# Altium schematic sheet S04.SchDoc: IEEE-1394/Ethernet FPGA Controller
size 381 x 254 mm; Revision: 2.1; SheetNumber: 4; SheetTotal: 6
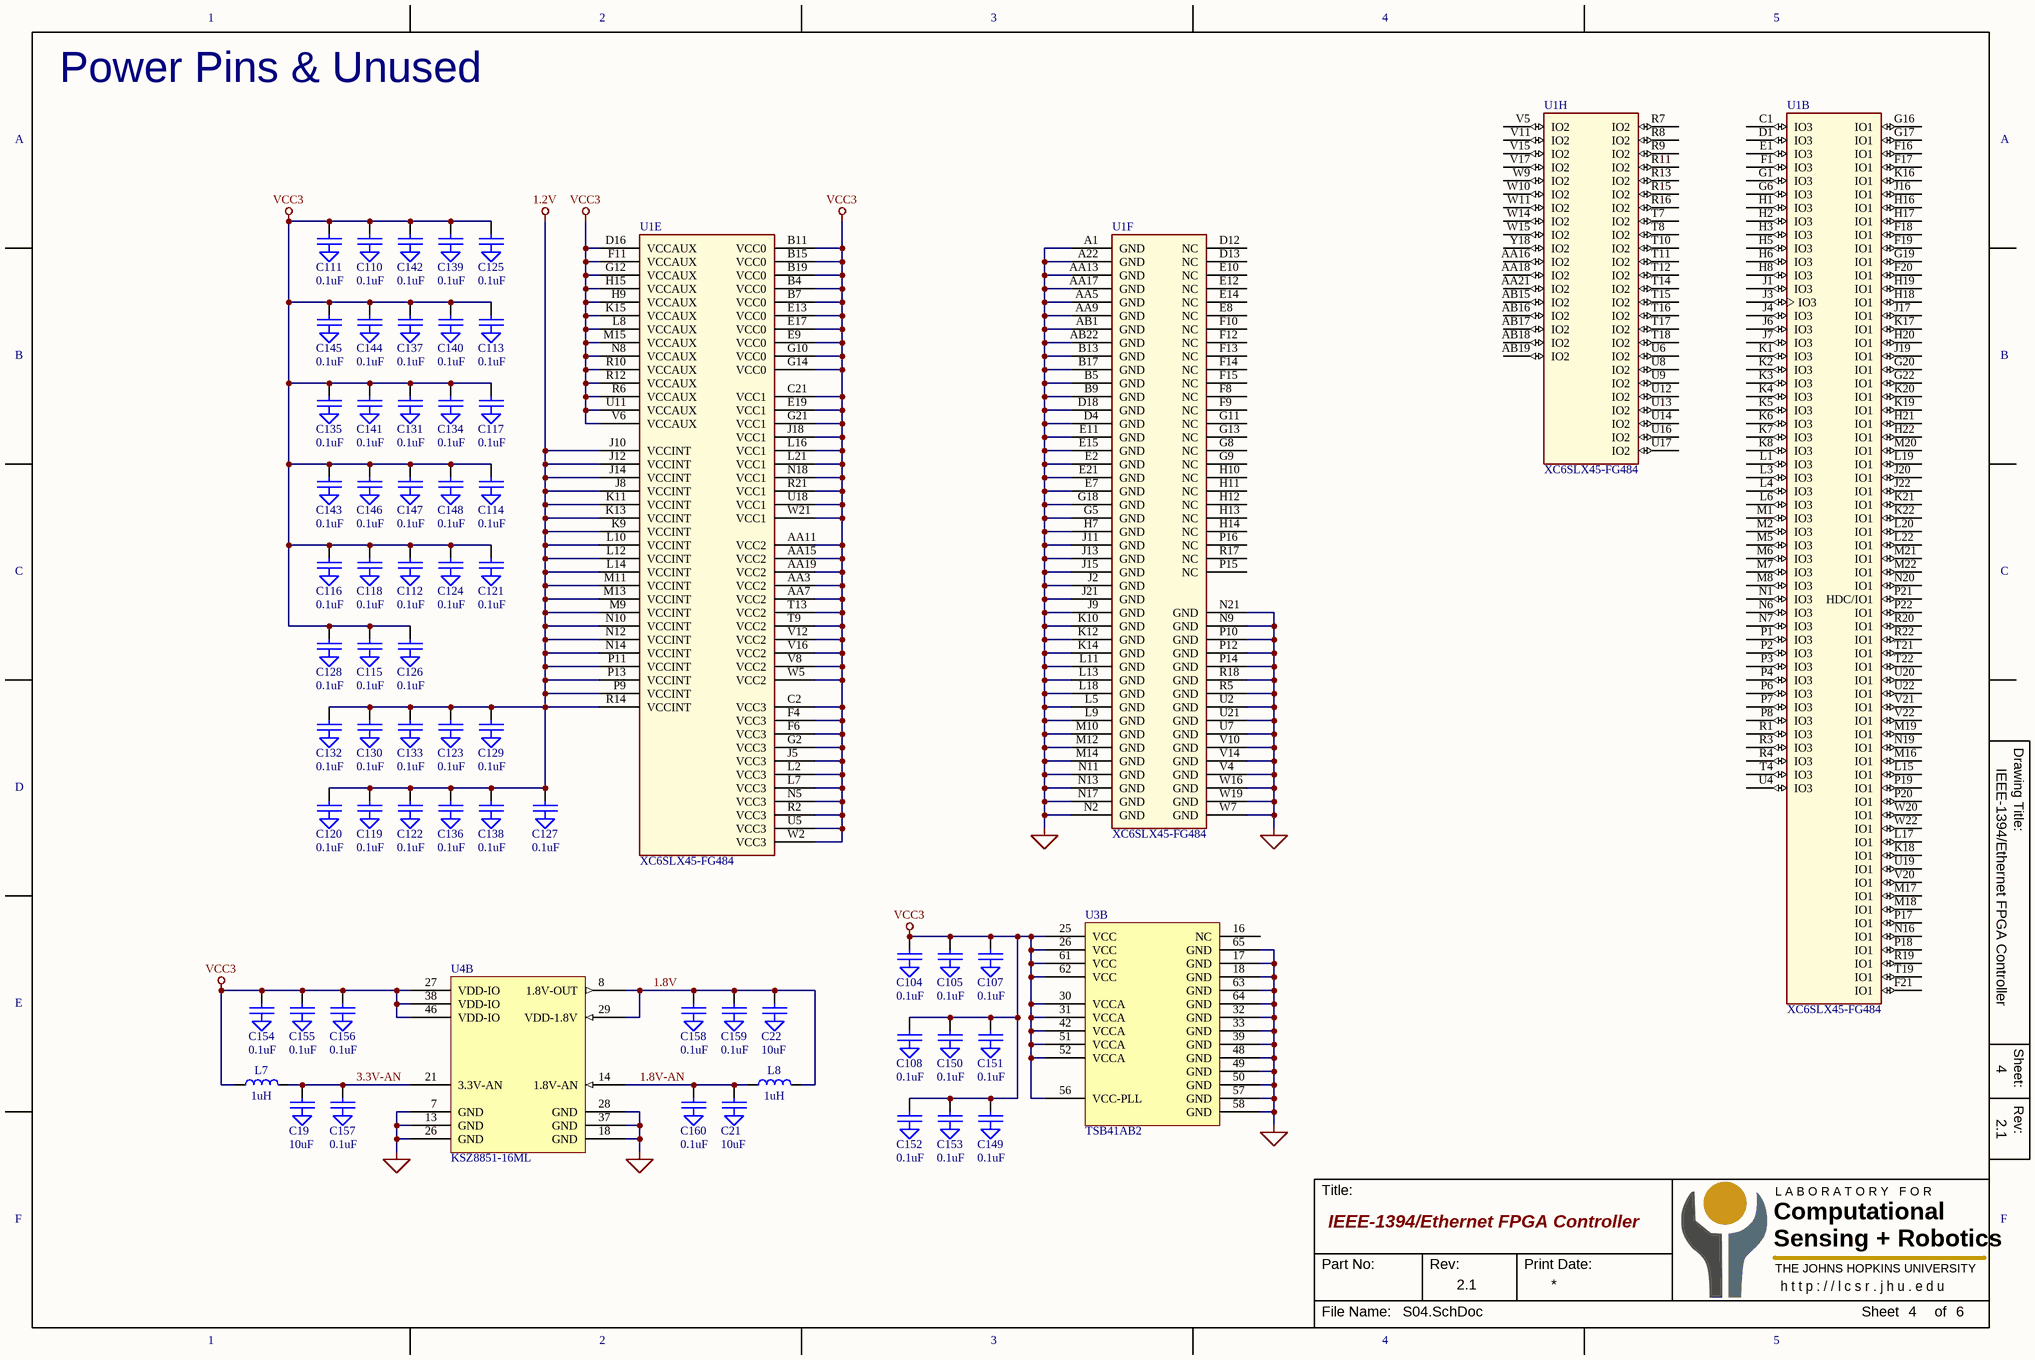
[diagram p0: S04.SchDoc]

## Parts
C19  10uF  [C0603]
C21  10uF  [C0603]
C22  10uF  [C0603]
C104  0.1uF  [C0402]
C105  0.1uF  [C0402]
C107  0.1uF  [C0402]
C108  0.1uF  [C0402]
C110  0.1uF  [C0402]
C111  0.1uF  [C0402]
C112  0.1uF  [C0402]
C113  0.1uF  [C0402]
C114  0.1uF  [C0402]
C115  0.1uF  [C0402]
C116  0.1uF  [C0402]
C117  0.1uF  [C0402]
C118  0.1uF  [C0402]
C119  0.1uF  [C0402]
C120  0.1uF  [C0402]
C121  0.1uF  [C0402]
C122  0.1uF  [C0402]
C123  0.1uF  [C0402]
C124  0.1uF  [C0402]
C125  0.1uF  [C0402]
C126  0.1uF  [C0402]
C127  0.1uF  [C0402]
C128  0.1uF  [C0402]
C129  0.1uF  [C0402]
C130  0.1uF  [C0402]
C131  0.1uF  [C0402]
C132  0.1uF  [C0402]
C133  0.1uF  [C0402]
C134  0.1uF  [C0402]
C135  0.1uF  [C0402]
C136  0.1uF  [C0402]
C137  0.1uF  [C0402]
C138  0.1uF  [C0402]
C139  0.1uF  [C0402]
C140  0.1uF  [C0402]
C141  0.1uF  [C0402]
C142  0.1uF  [C0402]
C143  0.1uF  [C0402]
C144  0.1uF  [C0402]
C145  0.1uF  [C0402]
C146  0.1uF  [C0402]
C147  0.1uF  [C0402]
C148  0.1uF  [C0402]
C149  0.1uF  [C0402]
C150  0.1uF  [C0402]
C151  0.1uF  [C0402]
C152  0.1uF  [C0402]
C153  0.1uF  [C0402]
C154  0.1uF  [C0402]
C155  0.1uF  [C0402]
C156  0.1uF  [C0402]
C157  0.1uF  [C0402]
C158  0.1uF  [C0402]
C159  0.1uF  [C0402]
C160  0.1uF  [C0402]
L7  1uH  [L0603]
L8  1uH  [L0603]
U1  XC6SLX45-FG484  [FG-484]  (parts B,E,F,H of 8)
U3  TSB41AB2  [PQFP-65]  (part B of 2)
U4  KSZ8851-16ML  [QFP-48-7MM]  (part B of 2)

## Nets
1.2V: C119.1 C120.1 C122.1 C123.1 C127.1 C129.1 C130.1 C132.1 C133.1 C136.1 C138.1 U1.J8(VCCINT) U1.J10(VCCINT) U1.J12(VCCINT) U1.J14(VCCINT) U1.K9(VCCINT) U1.K11(VCCINT) U1.K13(VCCINT) U1.L10(VCCINT) U1.L12(VCCINT) U1.L14(VCCINT) U1.M9(VCCINT) U1.M11(VCCINT) U1.M13(VCCINT) U1.N10(VCCINT) U1.N12(VCCINT) U1.N14(VCCINT) U1.P9(VCCINT) U1.P11(VCCINT) U1.P13(VCCINT) U1.R14(VCCINT)
GND: C19.2(GND) C21.2(GND) C22.2(GND) C104.2(GND) C105.2(GND) C107.2(GND) C108.2(GND) C110.2(GND) C111.2(GND) C112.2(GND) C113.2(GND) C114.2(GND) C115.2(GND) C116.2(GND) C117.2(GND) C118.2(GND) C119.2(GND) C120.2(GND) C121.2(GND) C122.2(GND) C123.2(GND) C124.2(GND) C125.2(GND) C126.2(GND) C127.2(GND) C128.2(GND) C129.2(GND) C130.2(GND) C131.2(GND) C132.2(GND) C133.2(GND) C134.2(GND) C135.2(GND) C136.2(GND) C137.2(GND) C138.2(GND) C139.2(GND) C140.2(GND) C141.2(GND) C142.2(GND) C143.2(GND) C144.2(GND) C145.2(GND) C146.2(GND) C147.2(GND) C148.2(GND) C149.2(GND) C150.2(GND) C151.2(GND) C152.2(GND) C153.2(GND) C154.2(GND) C155.2(GND) C156.2(GND) C157.2(GND) C158.2(GND) C159.2(GND) C160.2(GND) U1.A1(GND) U1.A22(GND) U1.AA5(GND) U1.AA9(GND) U1.AA13(GND) U1.AA17(GND) U1.AB1(GND) U1.AB22(GND) U1.B5(GND) U1.B9(GND) U1.B13(GND) U1.B17(GND) U1.D4(GND) U1.D18(GND) U1.E2(GND) U1.E7(GND) U1.E11(GND) U1.E15(GND) U1.E21(GND) U1.G5(GND) U1.G18(GND) U1.H7(GND) U1.J2(GND) U1.J9(GND) U1.J11(GND) U1.J13(GND) U1.J15(GND) U1.J21(GND) U1.K10(GND) U1.K12(GND) U1.K14(GND) U1.L5(GND) U1.L9(GND) U1.L11(GND) U1.L13(GND) U1.L18(GND) U1.M10(GND) U1.M12(GND) U1.M14(GND) U1.N2(GND) U1.N9(GND) U1.N11(GND) U1.N13(GND) U1.N17(GND) U1.N21(GND) U1.P10(GND) U1.P12(GND) U1.P14(GND) U1.R5(GND) U1.R18(GND) U1.U2(GND) U1.U7(GND) U1.U21(GND) U1.V4(GND) U1.V10(GND) U1.V14(GND) U1.W7(GND) U1.W16(GND) U1.W19(GND) U3.17(GND) U3.18(GND) U3.32(GND) U3.33(GND) U3.39(GND) U3.48(GND) U3.49(GND) U3.50(GND) U3.57(GND) U3.58(GND) U3.63(GND) U3.64(GND) U3.65(GND) U4.7(GND) U4.13(GND) U4.18(GND) U4.26(GND) U4.28(GND) U4.37(GND)
VCC3: C104.1 C105.1 C107.1 C108.1 C110.1 C111.1 C112.1 C113.1 C114.1 C115.1 C116.1 C117.1 C118.1 C121.1 C124.1 C125.1 C126.1 C128.1 C131.1 C134.1 C135.1 C137.1 C139.1 C140.1 C141.1 C142.1 C143.1 C144.1 C145.1 C146.1 C147.1 C148.1 C149.1 C150.1 C151.1 C152.1 C153.1 C154.1 C155.1 C156.1 L7.1 U1.AA3(VCC2) U1.AA7(VCC2) U1.AA11(VCC2) U1.AA15(VCC2) U1.AA19(VCC2) U1.B4(VCC0) U1.B7(VCC0) U1.B11(VCC0) U1.B15(VCC0) U1.B19(VCC0) U1.C2(VCC3) U1.C21(VCC1) U1.D16(VCCAUX) U1.E9(VCC0) U1.E13(VCC0) U1.E17(VCC0) U1.E19(VCC1) U1.F4(VCC3) U1.F6(VCC3) U1.F11(VCCAUX) U1.G2(VCC3) U1.G10(VCC0) U1.G12(VCCAUX) U1.G14(VCC0) U1.G21(VCC1) U1.H9(VCCAUX) U1.H15(VCCAUX) U1.J5(VCC3) U1.J18(VCC1) U1.K15(VCCAUX) U1.L2(VCC3) U1.L7(VCC3) U1.L8(VCCAUX) U1.L16(VCC1) U1.L21(VCC1) U1.M15(VCCAUX) U1.N5(VCC3) U1.N8(VCCAUX) U1.N18(VCC1) U1.R2(VCC3) U1.R6(VCCAUX) U1.R10(VCCAUX) U1.R12(VCCAUX) U1.R21(VCC1) U1.T9(VCC2) U1.T13(VCC2) U1.U5(VCC3) U1.U11(VCCAUX) U1.U18(VCC1) U1.V6(VCCAUX) U1.V8(VCC2) U1.V12(VCC2) U1.V16(VCC2) U1.W2(VCC3) U1.W5(VCC2) U1.W21(VCC1) U3.25(VCC) U3.26(VCC) U3.30(VCCA) U3.31(VCCA) U3.42(VCCA) U3.51(VCCA) U3.52(VCCA) U3.56(VCC-PLL) U3.61(VCC) U3.62(VCC) U4.27(VDD-IO) U4.38(VDD-IO) U4.46(VDD-IO)
1.8V: C22.1 C158.1 C159.1 L8.2 U4.8(1.8V-OUT) U4.29(VDD-1.8V)
1.8V-AN: C21.1 C160.1 L8.1 U4.14(1.8V-AN)
3.3V-AN: C19.1 C157.1 L7.2 U4.21(3.3V-AN)

Not connected (* = marked no-connect by the designer): U1 AA16(IO2) AA18(IO2) AA21(IO2) AB15(IO2) AB16(IO2) AB17(IO2) AB18(IO2) AB19(IO2) C1(IO3) D1(IO3) D12(NC) D13(NC) E1(IO3) E8(NC) E10(NC) E12(NC) E14(NC) F1(IO3) F8(NC) F9(NC) F10(NC) F12(NC) F13(NC) F14(NC) F15(NC) F16(IO1) F17(IO1) F18(IO1) F19(IO1) F20(IO1) F21(IO1) G1(IO3) G6(IO3) G8(NC) G9(NC) G11(NC) G13(NC) G16(IO1) G17(IO1) G19(IO1) G20(IO1) G22(IO1) H1(IO3) H2(IO3) H3(IO3) H5(IO3) H6(IO3) H8(IO3) H10(NC) H11(NC) H12(NC) H13(NC) H14(NC) H16(IO1) H17(IO1) H18(IO1) H19(IO1) H20(IO1) H21(IO1) H22(IO1) J1(IO3) J3(IO3) J4(IO3) J6(IO3) J7(IO3) J16(IO1) J17(IO1) J19(IO1) J20(IO1) J22(IO1) K1(IO3) K2(IO3) K3(IO3) K4(IO3) K5(IO3) K6(IO3) K7(IO3) K8(IO3) K16(IO1) K17(IO1) K18(IO1) K19(IO1) K20(IO1) K21(IO1) K22(IO1) L1(IO3) L3(IO3) L4(IO3) L6(IO3) L15(IO1) L17(IO1) L19(IO1) L20(IO1) L22(IO1) M1(IO3) M2(IO3) M5(IO3) M6(IO3) M7(IO3) M8(IO3) M16(IO1) M17(IO1) M18(IO1) M19(IO1) M20(IO1) M21(IO1) M22(IO1) N1(IO3) N6(IO3) N7(IO3) N16(IO1) N19(IO1) N20(IO1) P1(IO3) P2(IO3) P3(IO3) P4(IO3) P6(IO3) P7(IO3) P8(IO3) P15(NC) P16(NC) P17(IO1) P18(IO1) P19(IO1) P20(IO1) P21(HDC/IO1) P22(IO1) R1(IO3) R3(IO3) R4(IO3) R7(IO2) R8(IO2) R9(IO2) R11(IO2) R13(IO2) R15(IO2) R16(IO2) R17(NC) R19(IO1) R20(IO1) R22(IO1) T4(IO3) T7(IO2) T8(IO2) T10(IO2) T11(IO2) T12(IO2) T14(IO2) T15(IO2) T16(IO2) T17(IO2) T18(IO2) T19(IO1) T21(IO1) T22(IO1) U4(IO3) U6(IO2) U8(IO2) U9(IO2) U12(IO2) U13(IO2) U14(IO2) U16(IO2) U17(IO2) U19(IO1) U20(IO1) U22(IO1) V5(IO2) V11(IO2) V15(IO2) V17(IO2) V20(IO1) V21(IO1) V22(IO1) W9(IO2) W10(IO2) W11(IO2) W14(IO2) W15(IO2) W20(IO1) W22(IO1) Y18(IO2); U3 16(NC)

## Notes on the sheet
- Power Pins & Unused
- 1
- 2
- 3
- 4
- 5
- A
- B
- C
- Drawing Title:
- D
- E
- Sheet:
- Rev:
- F
- Title:
- Computational
- Sensing + Robotics
- L A B O R A T O R Y   F O R
- Part No:
- Print Date:
- THE JOHNS HOPKINS UNIVERSITY
- h t t p : / / l c s r . j h u . e d u
- File Name:
- Sheet
- of

## Library data of the parts
C19 C21 C22 C104 C105 C107 C108 C110-C160 = CAP-GND
L7 L8 = INDUCTOR
U3 = TSB41AB2: IEEE 1394a-2000 Two-port Transceiver/Arbiter